# EAGLE schematic VehicleSchematic (EAGLE 6.5.0)
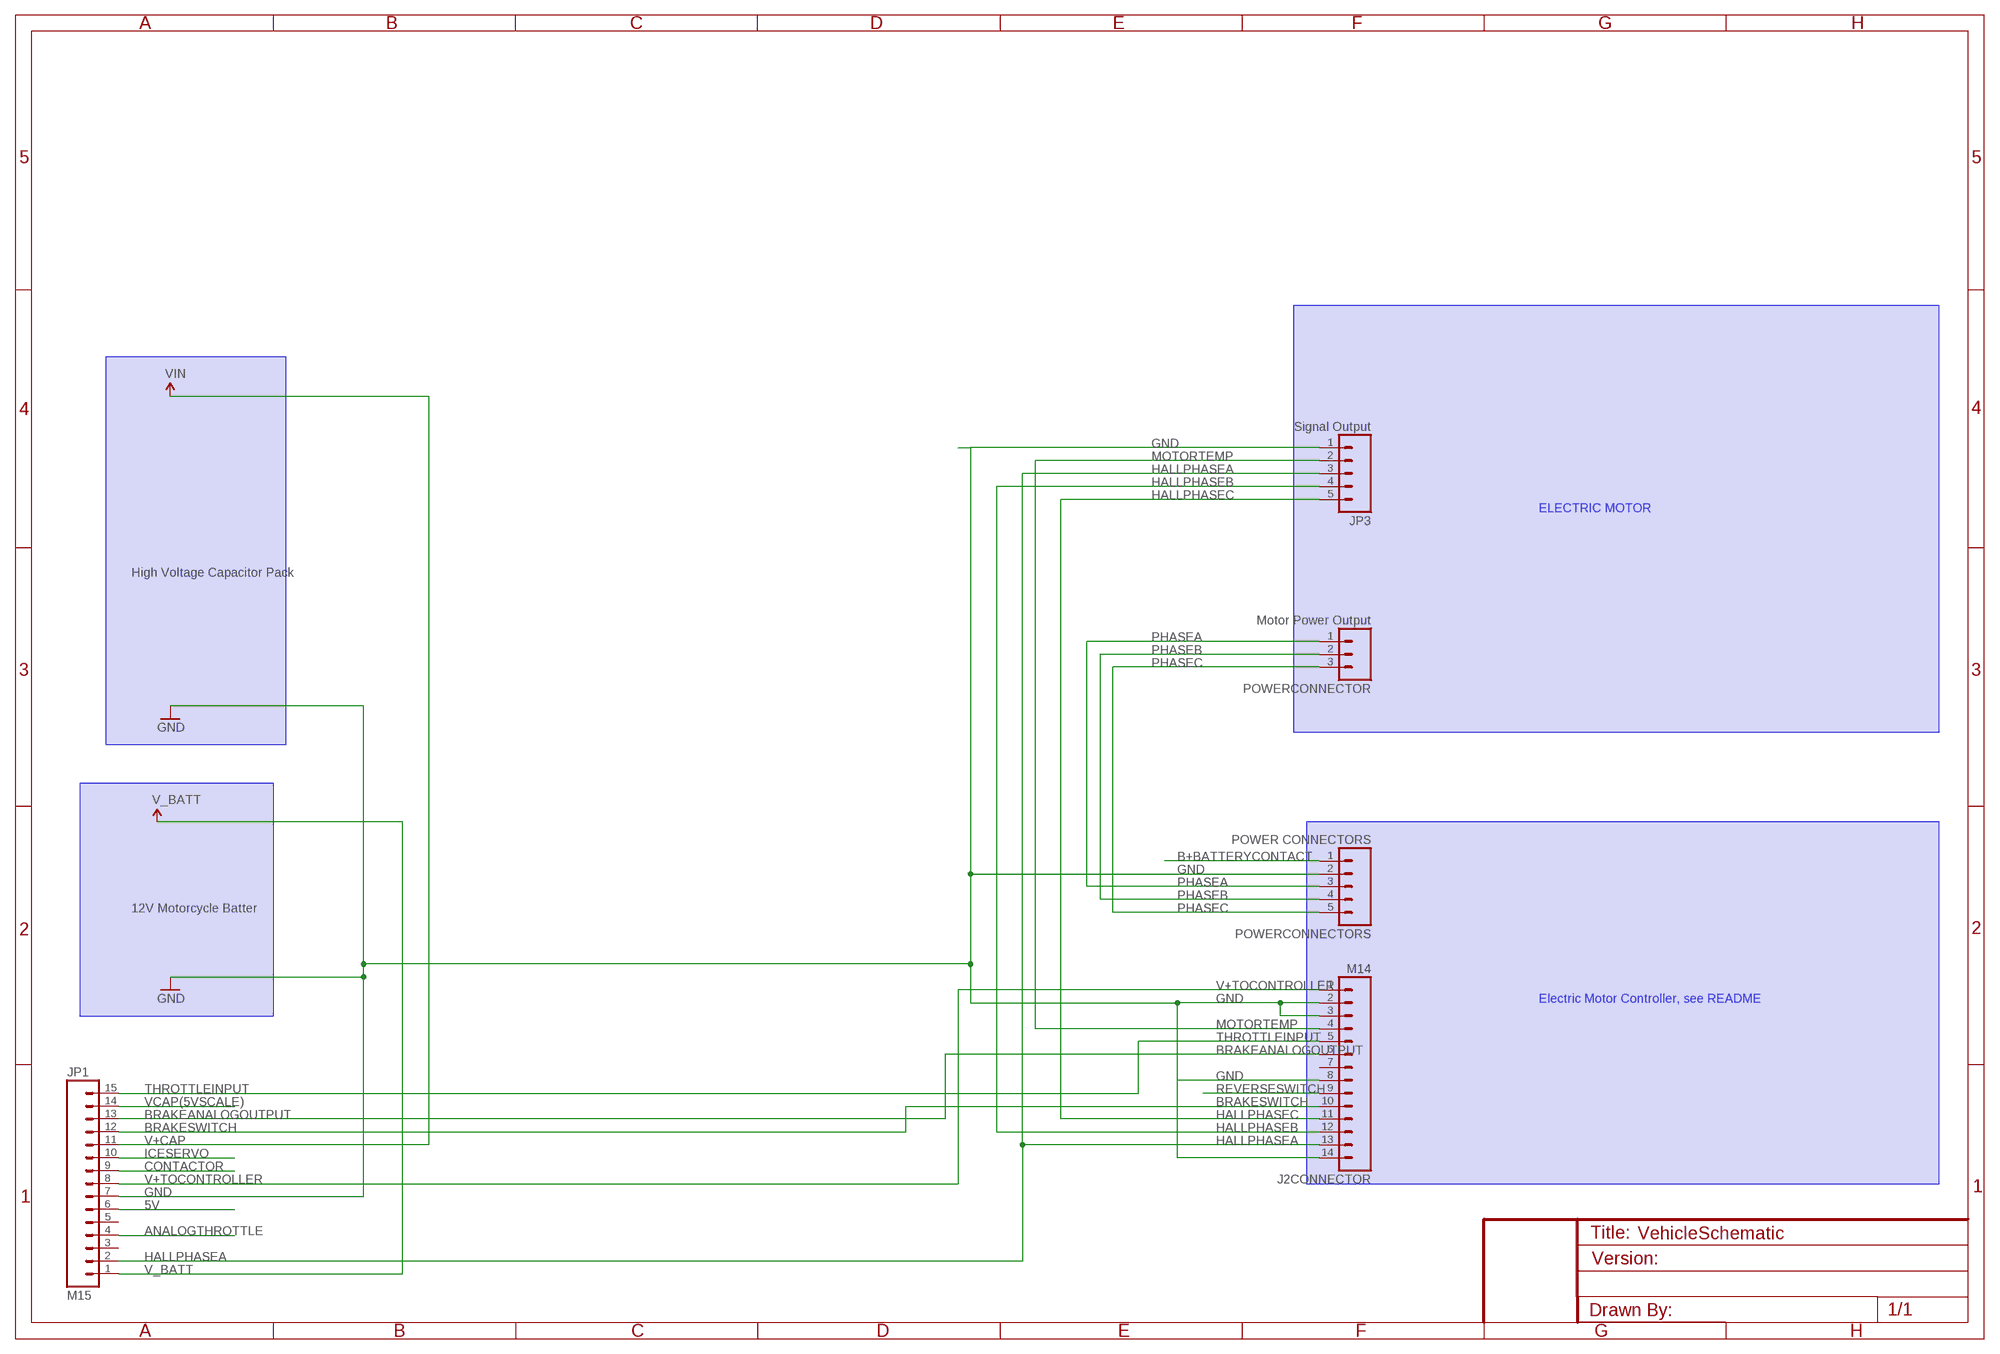
[diagram p0: schematic, sheet 1]

## Parts
J2CONNECTOR  M14  [1X14]
JP1  M15  [1X15]
JP3  Signal Output  M05NO_SILK  [1X05_NO_SILK]
POWERCONNECTOR  Motor Power Output  M03LONGPADS  [1X03_LONGPADS]
POWERCONNECTORS  POWER CONNECTORS  M05LOCK  [1X05_LOCK]

## Nets
5V: JP1.6
ANALOGTHROTTLE: JP1.4
B+BATTERYCONTACT: POWERCONNECTORS.1
BRAKEANALOGOUTPUT: J2CONNECTOR.6 JP1.13
BRAKESWITCH: J2CONNECTOR.10 JP1.12
CONTACTOR: JP1.9
GND: J2CONNECTOR.2 J2CONNECTOR.3 J2CONNECTOR.8 J2CONNECTOR.14 JP1.7 JP3.1 POWERCONNECTORS.2
HALLPHASEA: J2CONNECTOR.13 JP1.2 JP3.3
HALLPHASEB: J2CONNECTOR.12 JP3.4
HALLPHASEC: J2CONNECTOR.11 JP3.5
ICESERVO: JP1.10
MOTORTEMP: J2CONNECTOR.4 JP3.2
PHASEA: POWERCONNECTOR.1 POWERCONNECTORS.3
PHASEB: POWERCONNECTOR.2 POWERCONNECTORS.4
PHASEC: POWERCONNECTOR.3 POWERCONNECTORS.5
REVERSESWITCH: J2CONNECTOR.9
THROTTLEINPUT: J2CONNECTOR.5 JP1.15
V+CAP: JP1.11 ; supply symbol labelled VIN
V+TOCONTROLLER: J2CONNECTOR.1 JP1.8
V_BATT: JP1.1
VCAP(5VSCALE): JP1.14
Unconnected: J2CONNECTOR.7 JP1.3 JP1.5

## Notes on the sheet
- ELECTRIC MOTOR
- High Voltage Capacitor Pack
- 12V Motorcycle Batter
- Electric Motor Controller, see README

## Library data of the parts
J2CONNECTOR = SparkFun-Connectors:M14: Header 14 Standard 14-pin 0.1" header. Use with straight break away headers (SKU : PRT-00116), right angle break away headers (PRT-00553), swiss pins (PRT-00743), machine pins (PRT-00117), and female headers (PRT-00115).
JP1 = SparkFun:M15: Header 15 Standard 15-pin 0.1" header. Use with straight break away headers (SKU : PRT-00116), right angle break away headers (PRT-00553), swiss pins (PRT-00743), machine pins (PRT-00117), and female headers (PRT-00115).
JP3 POWERCONNECTORS = SparkFun-Connectors:M05: Header 5 Standard 5-pin 0.1" header. Use with straight break away headers (SKU : PRT-00116), right angle break away headers (PRT-00553), swiss pins (PRT-00743), machine pins (PRT-00117), and female headers (PRT-00115). Molex polarized connector foot print use with SKU : PRT-08230 with associated crimp pins and housings.
POWERCONNECTOR = SparkFun-Connectors:M03: Header 3 Standard 3-pin 0.1" header. Use with straight break away headers (SKU : PRT-00116), right angle break away headers (PRT-00553), swiss pins (PRT-00743), machine pins (PRT-00117), and female headers (PRT-00115). Molex polarized connector foot print use with SKU : PRT-08232 with associated crimp pins and housings.